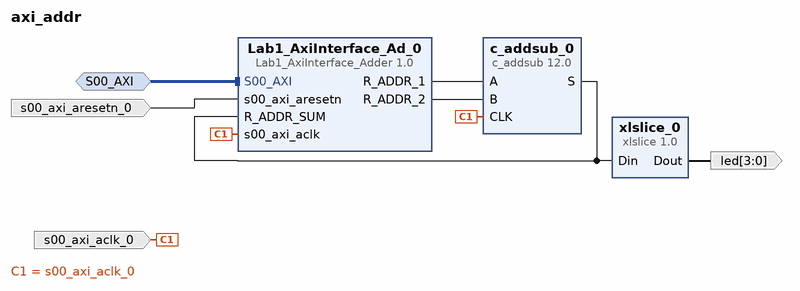
[diagram p0: block diagram of the top level]
# Vivado block design axi_addr, xc7z020clg400-1, Vivado 2022.1
create_bd_design axi_addr

create_bd_intf_port -mode Slave -vlnv xilinx.com:interface:aximm_rtl:1.0 S00_AXI
set_property -dict [list \
  CONFIG.ADDR_WIDTH 16 \
  CONFIG.ARUSER_WIDTH 0 \
  CONFIG.AWUSER_WIDTH 0 \
  CONFIG.BUSER_WIDTH 0 \
  CONFIG.DATA_WIDTH 32 \
  CONFIG.HAS_BRESP 1 \
  CONFIG.HAS_BURST 0 \
  CONFIG.HAS_CACHE 0 \
  CONFIG.HAS_LOCK 0 \
  CONFIG.HAS_PROT 1 \
  CONFIG.HAS_QOS 0 \
  CONFIG.HAS_REGION 0 \
  CONFIG.HAS_RRESP 1 \
  CONFIG.HAS_WSTRB 1 \
  CONFIG.ID_WIDTH 0 \
  CONFIG.MAX_BURST_LENGTH 1 \
  CONFIG.NUM_READ_OUTSTANDING 1 \
  CONFIG.NUM_READ_THREADS 1 \
  CONFIG.NUM_WRITE_OUTSTANDING 1 \
  CONFIG.NUM_WRITE_THREADS 1 \
  CONFIG.PROTOCOL AXI4LITE \
  CONFIG.READ_WRITE_MODE READ_WRITE \
  CONFIG.RUSER_BITS_PER_BYTE 0 \
  CONFIG.RUSER_WIDTH 0 \
  CONFIG.SUPPORTS_NARROW_BURST 0 \
  CONFIG.WUSER_BITS_PER_BYTE 0 \
  CONFIG.WUSER_WIDTH 0 \
] [get_bd_intf_ports S00_AXI]
create_bd_port -dir O -from 3 -to 0 led
create_bd_port -dir I -type clk s00_axi_aclk_0
set_property -dict {CONFIG.ASSOCIATED_BUSIF S00_AXI} [get_bd_ports s00_axi_aclk_0]
create_bd_port -dir I -type rst s00_axi_aresetn_0

create_bd_cell -type ip -vlnv xilinx.com:ip:c_addsub:12.0 c_addsub_0
set_property -dict [list \
  CONFIG.A_Width 32 \
  CONFIG.B_Value 00000000000000000000000000000000 \
  CONFIG.B_Width 32 \
  CONFIG.Latency 1 \
  CONFIG.Out_Width 32 \
] [get_bd_cells c_addsub_0]
create_bd_cell -type ip -vlnv xilinx.com:ip:xlslice:1.0 xlslice_0
set_property -dict {CONFIG.DIN_FROM 3 CONFIG.DOUT_WIDTH 4} [get_bd_cells xlslice_0]
create_bd_cell -type ip -vlnv xilinx.com:user:Lab1_AxiInterface_Adder:1.0 Lab1_AxiInterface_Ad_0

# ---- connections ----

connect_bd_intf_net -intf_net S00_AXI_0_1 [get_bd_intf_ports S00_AXI] [get_bd_intf_pins Lab1_AxiInterface_Ad_0/S00_AXI]
connect_bd_net [get_bd_pins Lab1_AxiInterface_Ad_0/R_ADDR_1] [get_bd_pins c_addsub_0/A]
connect_bd_net [get_bd_pins Lab1_AxiInterface_Ad_0/R_ADDR_2] [get_bd_pins c_addsub_0/B]
connect_bd_net [get_bd_pins c_addsub_0/S] [get_bd_pins xlslice_0/Din] [get_bd_pins Lab1_AxiInterface_Ad_0/R_ADDR_SUM]
connect_bd_net -net s00_axi_aclk_0_1 [get_bd_ports s00_axi_aclk_0] [get_bd_pins c_addsub_0/CLK] [get_bd_pins Lab1_AxiInterface_Ad_0/s00_axi_aclk]
connect_bd_net -net s00_axi_aresetn_0_1 [get_bd_ports s00_axi_aresetn_0] [get_bd_pins Lab1_AxiInterface_Ad_0/s00_axi_aresetn]
connect_bd_net [get_bd_pins xlslice_0/Dout] [get_bd_ports led]

# ---- address map ----
assign_bd_address -offset 0x0000 -range 4K -target_address_space [get_bd_addr_spaces S00_AXI] [get_bd_addr_segs Lab1_AxiInterface_Ad_0/S00_AXI/S00_AXI_reg]

validate_bd_design
save_bd_design
